# EAGLE design Coulomb counter (EAGLE 9.6.2)
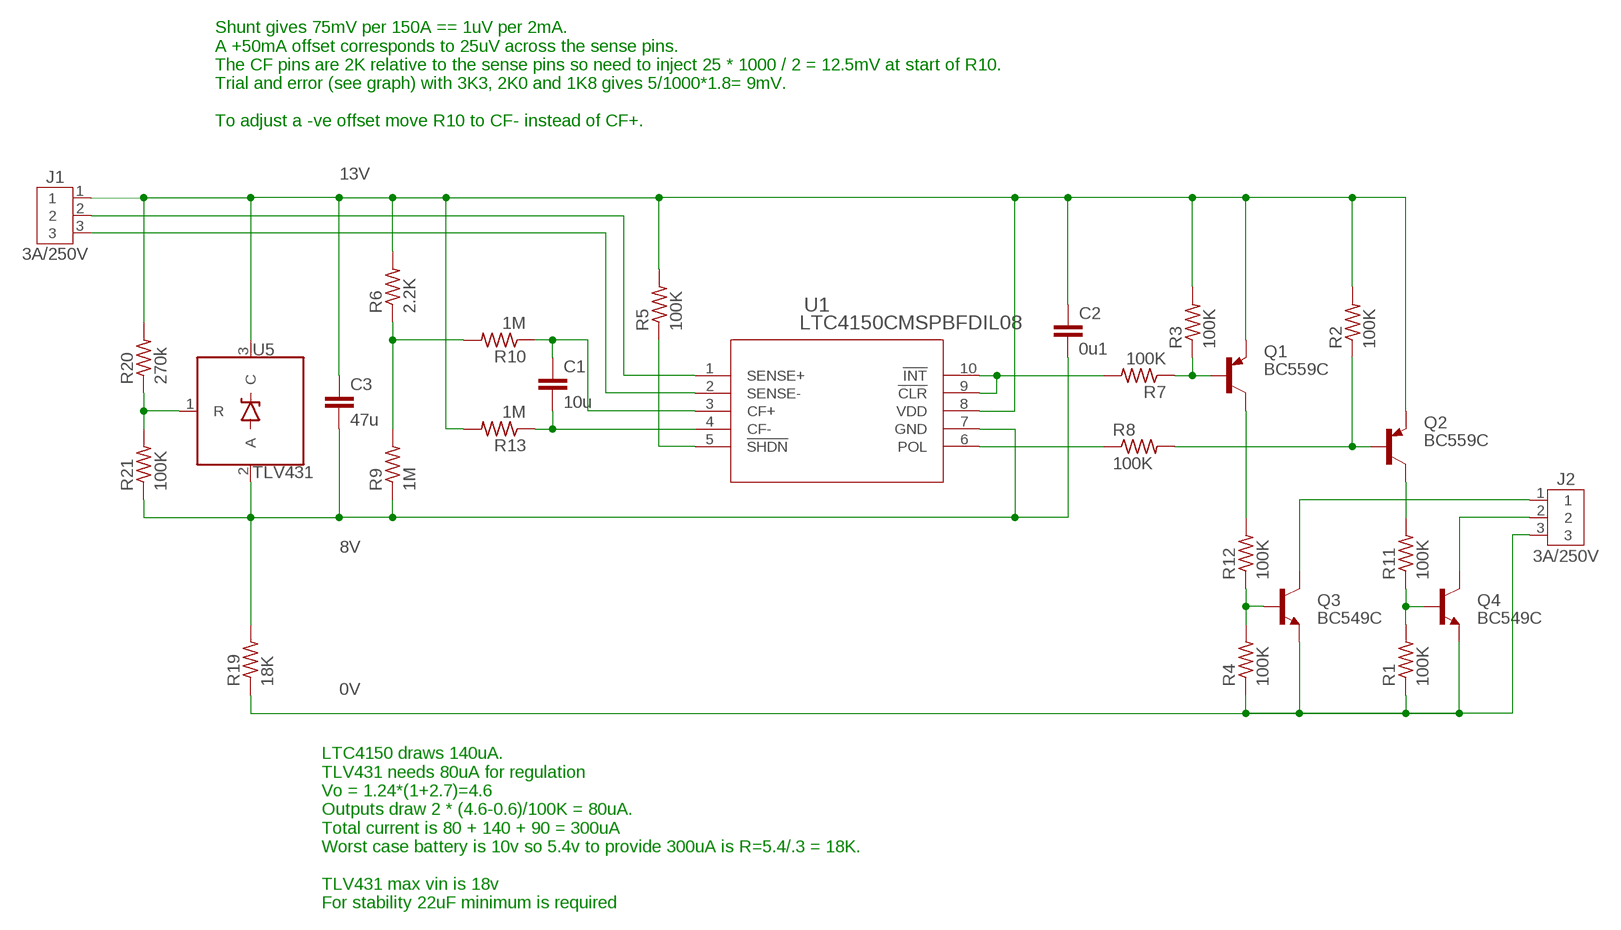
[diagram p0: schematic, sheet 1]

## Parts
C1  10u  C2.5/2  [C2.5-2]
C2  0u1  C2.5/2  [C2.5-2]
C3  47u  C2.5/2  [C2.5-2]
J1  3A/250V  B3B-XH-A  [B3B-XH-A]
J2  3A/250V  B3B-XH-A  [B3B-XH-A]
Q1  BC559C  [TO92-EBC]
Q2  BC559C  [TO92-EBC]
Q3  BC549C  [TO92-EBC]
Q4  BC549C  [TO92-EBC]
R1  100K  RES_7  [0204/7]
R2  100K  RES_7  [0204/7]
R3  100K  RES_7  [0204/7]
R4  100K  RES_7  [0204/7]
R5  100K  RES_7  [0204/7]
R6  2.2K  RES_7  [0204/7]
R7  100K  RES_7  [0204/7]
R8  100K  RES_7  [0204/7]
R9  1M  RES_7  [0204/7]
R10  1M  RES_7  [0204/7]
R11  100K  RES_7  [0204/7]
R12  100K  RES_7  [0204/7]
R13  1M  RES_7  [0204/7]
R19  18K  RES_7  [0204/7]
R20  270k  RES_7  [0204/7]
R21  100K  RES_7  [0204/7]
U1  LTC4150CMSPBFDIL08  [DIL10]
U5  TLV431  [TO92]

## Nets
0V: J2.3 Q3.E Q4.E R1.1 R4.1 R19.1
8V: C2.2 C3.2 R9.1 R19.2 R21.1 U1.7(GND) U5.2(A)
13V: C2.1 C3.1 J1.1 Q1.E Q2.E R2.2 R3.2 R5.2 R6.2 R13.2 R20.2 U1.8(VDD) U5.3(C)
N$1: J2.1 Q3.C
N$2: R8.1 U1.6(POL)
N$3: R5.1 U1.5(!SHDN)
N$5: C1.2 R13.1 U1.4(CF-)
N$6: J1.3 U1.2(SENSE-)
N$7: R6.1 R9.2 R10.2
N$8: J2.2 Q4.C
N$9: C1.1 R10.1 U1.3(CF+)
N$20: Q1.B R3.1 R7.1
N$21: Q2.B R2.1 R8.2
N$22: Q2.C R11.2
N$23: Q1.C R12.2
N$24: Q3.B R4.2 R12.1
N$25: Q4.B R1.2 R11.1
N$26: R7.2 U1.9(!CLR) U1.10(!INT)
N$42: R20.1 R21.2 U5.1(R)
S+: J1.2 U1.1(SENSE+)

## Notes on the sheet
- Shunt gives 75mV per 150A == 1uV per 2mA.
  A +50mA offset corresponds to 25uV across the sense pins.
  The CF pins are 2K relative to the sense pins so need to inject 25 * 1000 / 2 = 12.5mV at start of R10.
  Trial and error (see graph) with 3K3, 2K0 and 1K8 gives 5/1000*1.8= 9mV.
  
  To adjust a -ve offset move R10 to CF- instead of CF+.
- LTC4150 draws 140uA.
  TLV431 needs 80uA for regulation
  Vo = 1.24*(1+2.7)=4.6
  Outputs draw 2 * (4.6-0.6)/100K = 80uA.
  Total current is 80 + 140 + 90 = 300uA
  Worst case battery is 10v so 5.4v to provide 300uA is R=5.4/.3 = 18K.
  
  TLV431 max vin is 18v
  For stability 22uF minimum is required

## Library data of the parts
C1-C3 = capacitor-wima:C: CAPACITOR naming: grid - package width
J1 J2 = andrew-boyson:B3B-XH-A: XH Connector Top Entry - 3POS Details see: Datasheet <http://www.jst-mfg.com/product/pdf/eng/eXH.pdf>; CATEGORY: CONNECTOR; DESCRIPTION: 2.5mm pitch/disconnectable crimp style connector; MANUFACTURER: JST (XH connector); MPN: B3B-XH-A; PART_STATUS: ACTIVE; ROHS_COMPLIANT: COMPLIANT; SERIES: B3B-XH-A; SUB_CATEGORY: THROUGH HOLE CONNECTOR; TYPE: SIDE ENTRY
Q1 Q2 = transistor-pnp:BC559*: PNP Transistror
Q3 Q4 = transistor-npn:BC549*: NPN Transistor
R1-R13 R19-R21 = andrew-boyson:RES_7: RESISTOR, American symbol
U1 = andrew-boyson:LTC4150CMSPBF
U5 = andrew-boyson:TLV431: TLV431

## Board
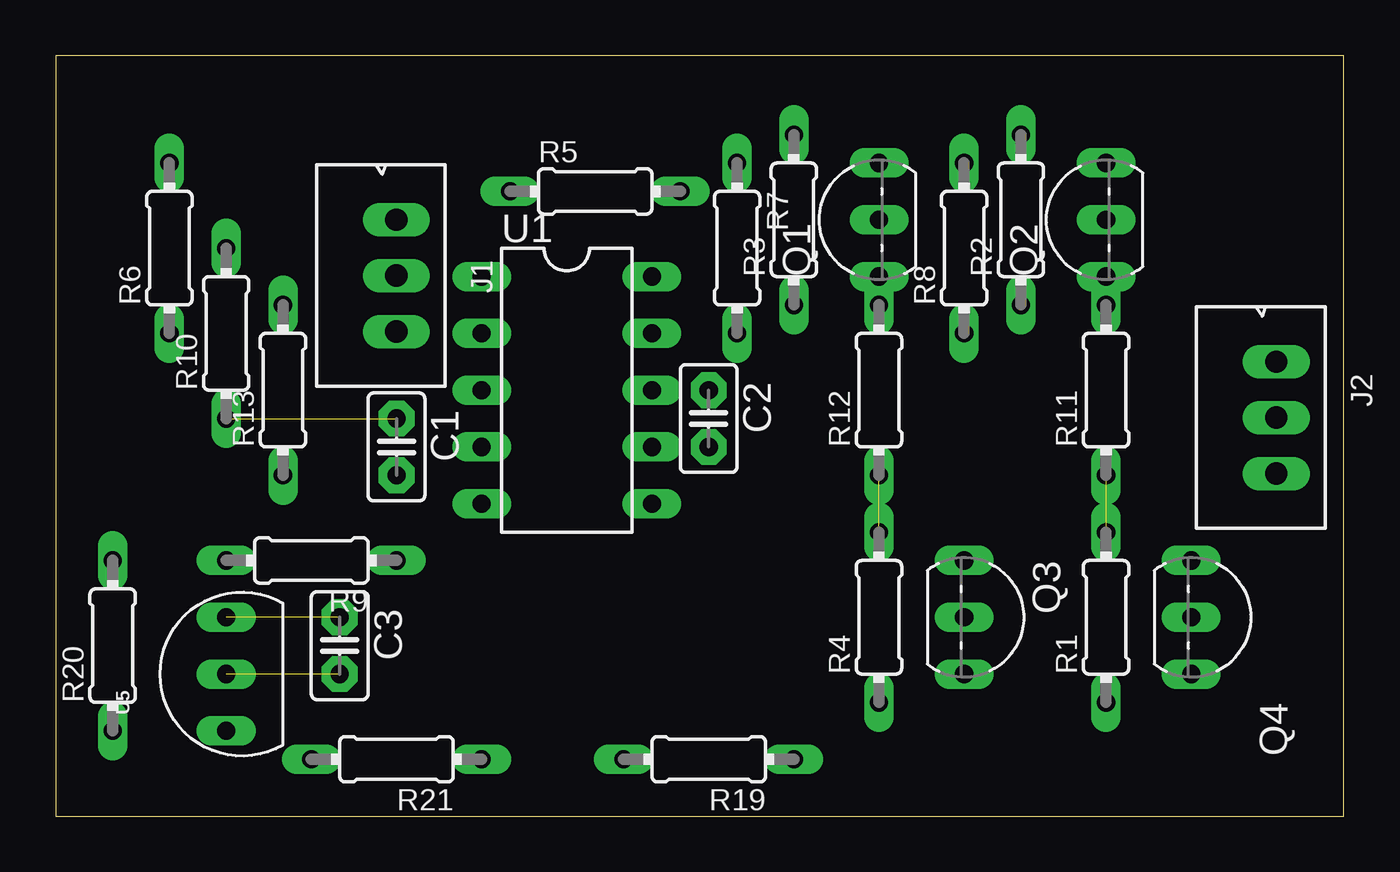
[diagram p1: board, top side]
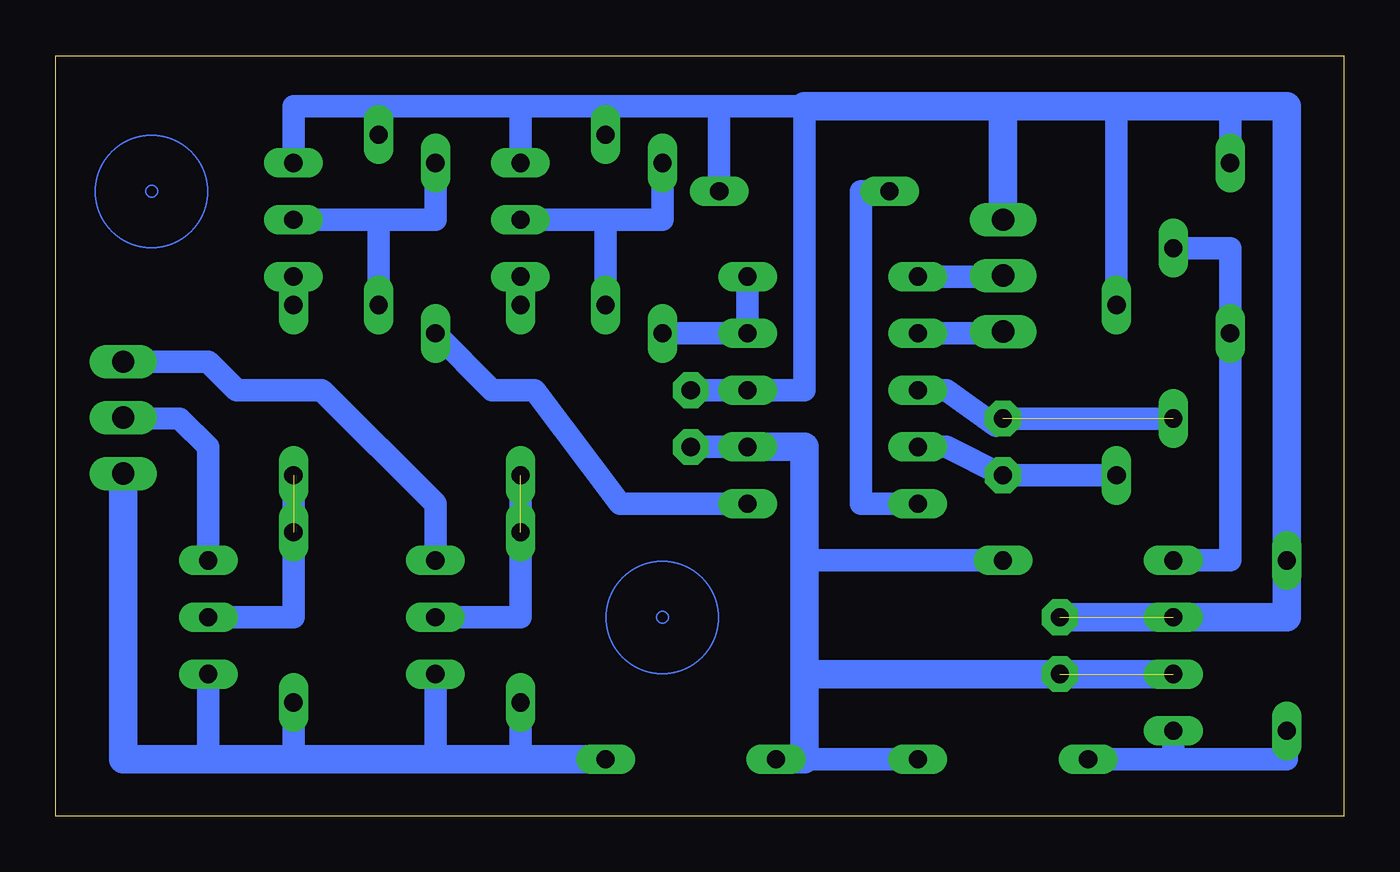
[diagram p2: board, bottom side, seen from below]

Size 57.62 x 34 mm. Coordinates in mm from the lower left corner, seen from the top.
Outline: 0,0 57.62,0 57.62,34 0,34 0,0
Copper layers (1*16): Top 0.035mm / dielectric 1.5mm / Bottom 0.035mm
Design rules "default": minimum track width 6mil, minimum drill 0.35mm, track to track 6mil, track to pad 6mil, pad to pad 6mil, via to via 6mil, smd to smd 6mil, copper to edge 40mil, drill to drill 6mil, minimum pad ring 10mil, minimum via ring 8mil, stop-mask expansion 4mil, vias tented up to drill 0mil, thermal gap 10mil

### Footprints (pad centres in the part's own frame; a part is rotated, then mirrored left to right if it is on the bottom)
C2.5-2 = drill 0.813 pad 1.6 octagon: 1 -1.27,0; 2 1.27,0
B3B-XH-A = drill 1 long: 1 0,1.27; 2 2.5,1.27; 3 5,1.27
TO92-EBC = drill 0.813 long: B 0,-1.27; C -2.54,-1.27; E 2.54,-1.27
0204/7 = drill 0.813 long: 1 -3.81,0; 2 3.81,0
DIL10 = drill 0.813 long: 1 -5.08,-3.81; 2 -2.54,-3.81; 3 0,-3.81; 4 2.54,-3.81; 5 5.08,-3.81; 6 5.08,3.81; 7 2.54,3.81; 8 0,3.81; 9 -2.54,3.81; 10 -5.08,3.81
TO92 = drill 0.813 long: 1 -2.54,0; 2 0,0; 3 2.54,0

### Placement (x,y rotation side)
C1  15.24,16.51 270 top
C2  29.21,17.78 270 top
C3  12.7,7.62 270 top
J1  13.97,26.67 270 top
J2  53.34,20.32 270 top
Q1  35.56,26.67 90 top
Q2  45.72,26.67 90 top
Q3  41.91,8.89 270 top
Q4  52.07,8.89 270 top
R1  46.99,8.89 90 top
R2  43.18,26.67 90 top
R3  33.02,26.67 90 top
R4  36.83,8.89 90 top
R5  24.13,27.94 0 top
R6  5.08,25.4 90 top
R7  30.48,25.4 270 top
R8  40.64,25.4 90 top
R9  11.43,11.43 180 top
R10  7.62,21.59 90 top
R11  46.99,19.05 90 top
R12  36.83,19.05 90 top
R13  10.16,19.05 90 top
R19  29.21,2.54 180 top
R20  2.54,7.62 90 top
R21  15.24,2.54 180 top
U1  22.86,19.05 270 top
U5  7.62,6.35 90 top

### Tracks (layer width: path | path; a pad name or v marks a point on that pad's centre or on a via)
0V
  Bottom 1.016: R1.1 46.99,2.54 | Q3.E 40.64,2.54 | R4.1 36.83,2.54 | Q4.E 50.8,2.54
  Bottom 1.27: J2.3 54.61,2.54 50.8,2.54 46.99,2.54 40.64,2.54 36.83,2.54 R19.1
8V  (1 unrouted)
  Bottom 1.016: R21.1 24.13,2.54 | 24.13,11.43 R9.1 | C2.2 U1.7
  Bottom 1.27: U1.7 24.13,16.51 24.13,11.43 24.13,6.35 | 24.13,6.35 24.13,2.54 R19.2 | U5.2 C3.2 24.13,6.35
13V  (1 unrouted)
  Bottom 1.016: 43.18,31.75 46.99,31.75 Q2.E | 43.18,31.75 36.83,31.75 | 36.83,31.75 33.02,31.75 | 33.02,31.75 27.94,31.75 | 27.94,31.75 24.13,31.75 24.13,19.05 U1.8 C2.1 | R5.2 27.94,31.75 | R2.2 43.18,31.75 | Q1.E 36.83,31.75 | R3.2 33.02,31.75 | R6.2 5.08,31.75 | R13.2 10.16,31.75
  Bottom 1.27: J1.1 15.24,31.75 | 15.24,31.75 10.16,31.75 5.08,31.75 2.54,31.75 R20.2 2.54,8.89 U5.3 C3.1 | 15.24,31.75 24.13,31.75
N$1
  Bottom 1.016: Q3.C 40.64,13.97 45.72,19.05 49.53,19.05 50.8,20.32 J2.1
N$2
  Bottom 1.016: U1.6 32.38,13.97 36.2,19.05 38.1,19.05 R8.1
N$3
  Bottom 1.016: U1.5 21.59,13.97 21.59,27.94 R5.1
N$5
  Bottom 1.016: U1.4 17.78,16.51 C1.2 R13.1
N$6
  Bottom 1.016: J1.3 16.51,21.59 U1.2
N$7
  Bottom 1.016: R9.2 5.08,11.43 R6.1 5.08,25.4 R10.2
N$8
  Bottom 1.016: J2.2 52.07,17.78 50.8,16.51 Q4.C
N$9  (1 unrouted)
  Bottom 1.016: U1.3 17.78,19.05 15.56,17.46 | R10.1 C1.1
N$20
  Bottom 1.016: Q1.B 33.02,26.67 | 33.02,26.67 30.48,26.67 R7.1 | 33.02,26.67 R3.1
N$21
  Bottom 1.016: Q2.B 43.18,26.67 | 43.18,26.67 40.64,26.67 R8.2 | 43.18,26.67 R2.1
N$22
  Bottom 1.016: Q2.C R11.2
N$23
  Bottom 1.016: Q1.C R12.2
N$24  (1 unrouted)
  Bottom 1.016: R12.1 R4.2 36.83,8.89 Q3.B
N$25  (1 unrouted)
  Bottom 1.016: R11.1 R1.2 46.99,8.89 Q4.B
N$26
  Bottom 1.016: U1.10 U1.9 R7.2
N$42
  Bottom 1.016: R21.2 7.62,2.54 | 7.62,2.54 2.54,2.54 R20.1 | U5.1 7.62,2.54
S+
  Bottom 1.016: J1.2 16.51,24.13 U1.1
(copper drawn outside any net)
  shapes: Bottom circle x4